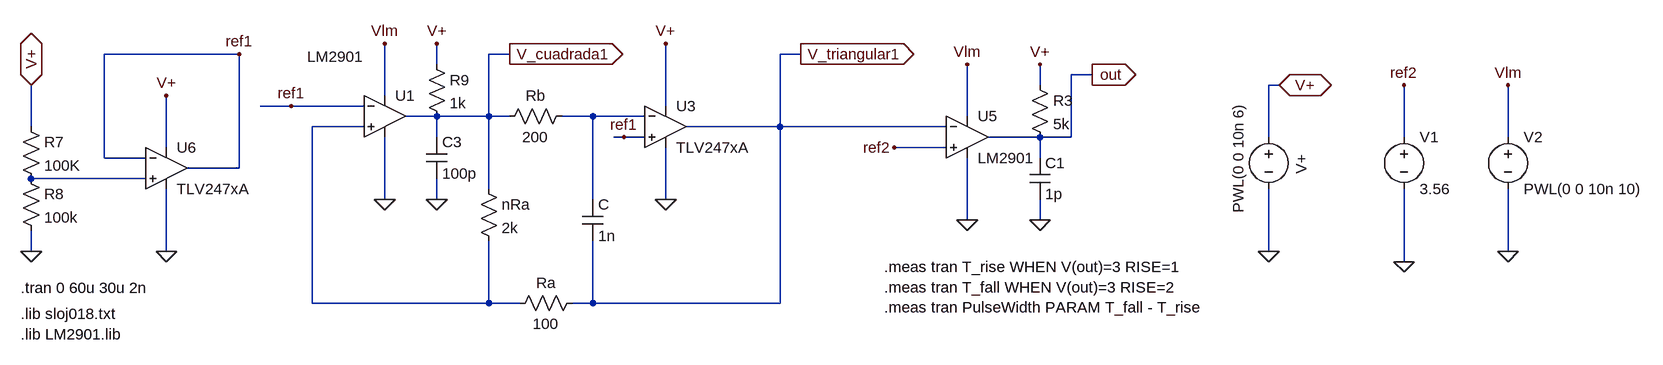
[diagram p0: schematic PWM.asc]
PWM.asc, the LTspice schematic file:
Version 4
SHEET 1 1432 1160
WIRE -752 -368 -960 -368
WIRE -336 -368 -368 -368
WIRE 112 -368 80 -368
WIRE -448 -352 -448 -384
WIRE 560 -336 528 -336
WIRE 480 -320 480 -352
WIRE 848 -320 832 -320
WIRE -528 -304 -528 -384
WIRE -672 -288 -720 -288
WIRE -560 -288 -672 -288
WIRE -96 -288 -96 -384
WIRE -448 -272 -496 -272
WIRE -368 -272 -368 -368
WIRE -368 -272 -448 -272
WIRE -336 -272 -368 -272
WIRE -208 -272 -256 -272
WIRE -128 -272 -208 -272
WIRE 368 -272 368 -352
WIRE -1072 -256 -1072 -320
WIRE -560 -256 -640 -256
WIRE 80 -256 80 -368
WIRE 80 -256 -64 -256
WIRE 336 -256 80 -256
WIRE -448 -240 -448 -272
WIRE -160 -240 -176 -240
WIRE -128 -240 -160 -240
WIRE 480 -240 400 -240
WIRE 528 -240 528 -336
WIRE 528 -240 480 -240
WIRE 832 -240 832 -320
WIRE 1040 -240 1040 -320
WIRE 1200 -240 1200 -320
WIRE -864 -224 -864 -304
WIRE 336 -224 256 -224
WIRE -960 -208 -960 -368
WIRE -896 -208 -960 -208
WIRE 480 -208 480 -240
WIRE -752 -192 -752 -368
WIRE -752 -192 -832 -192
WIRE -896 -176 -1072 -176
WIRE -368 -160 -368 -272
WIRE -528 -144 -528 -240
WIRE -448 -144 -448 -176
WIRE -208 -144 -208 -272
WIRE -96 -144 -96 -224
WIRE 368 -112 368 -208
WIRE 480 -112 480 -144
WIRE -1072 -64 -1072 -96
WIRE -864 -64 -864 -160
WIRE 832 -64 832 -160
WIRE 1200 -64 1200 -160
WIRE 1040 -48 1040 -160
WIRE -640 16 -640 -256
WIRE -368 16 -368 -80
WIRE -368 16 -640 16
WIRE -320 16 -368 16
WIRE -208 16 -208 -80
WIRE -208 16 -240 16
WIRE 80 16 80 -256
WIRE 80 16 -208 16
FLAG 832 -64 0
FLAG 848 -320 V+
IOPIN 848 -320 BiDir
FLAG 112 -368 V_triangular1
IOPIN 112 -368 Out
FLAG -336 -368 V_cuadrada1
IOPIN -336 -368 Out
FLAG -528 -384 Vlm
FLAG -96 -384 V+
FLAG 560 -336 out
IOPIN 560 -336 Out
FLAG 368 -352 Vlm
FLAG -864 -304 V+
FLAG 368 -112 0
FLAG -1072 -64 0
FLAG -1072 -320 V+
IOPIN -1072 -320 BiDir
FLAG -752 -368 ref1
FLAG -672 -288 ref1
FLAG -160 -240 ref1
FLAG -96 -144 0
FLAG -528 -144 0
FLAG -864 -64 0
FLAG 256 -224 ref2
FLAG 480 -112 0
FLAG 480 -352 V+
FLAG 1200 -64 0
FLAG 1200 -320 Vlm
FLAG -448 -144 0
FLAG -448 -384 V+
FLAG 1040 -48 0
FLAG 1040 -320 ref2
SYMBOL voltage 832 -256 R0
WINDOW 123 0 0 Left 0
WINDOW 39 0 0 Left 0
WINDOW 0 50 43 VRight 2
WINDOW 3 -47 -36 VRight 2
SYMATTR InstName V+
SYMATTR Value PWL(0 0 10n 6)
SYMBOL res -240 -288 R90
WINDOW 0 0 56 VBottom 2
WINDOW 3 32 56 VTop 2
SYMATTR InstName Rb
SYMATTR Value 200
SYMBOL res -224 0 R90
WINDOW 0 0 56 VBottom 2
WINDOW 3 32 56 VTop 2
SYMATTR InstName Ra
SYMATTR Value 100
SYMBOL res -384 -176 R0
SYMATTR InstName nRa
SYMATTR Value 2k
SYMBOL cap -224 -144 R0
SYMATTR InstName C
SYMATTR Value 1n
SYMBOL opamp2 -96 -320 R0
SYMATTR InstName U3
SYMATTR Value TLV247xA
SYMBOL opamp2 368 -304 R0
SYMATTR InstName U5
SYMATTR Value LM2901
SYMBOL opamp2 -864 -256 R0
SYMATTR InstName U6
SYMATTR Value TLV247xA
SYMBOL res -1088 -272 R0
SYMATTR InstName R7
SYMATTR Value 100K
SYMBOL res -1088 -192 R0
SYMATTR InstName R8
SYMATTR Value 100k
SYMBOL res 464 -336 R0
SYMATTR InstName R3
SYMATTR Value 5k
SYMBOL cap 464 -208 R0
SYMATTR InstName C1
SYMATTR Value 1p
SYMBOL voltage 1200 -256 R0
WINDOW 123 0 0 Left 0
WINDOW 39 0 0 Left 0
SYMATTR InstName V2
SYMATTR Value PWL(0 0 10n 10)
SYMBOL cap -464 -240 R0
SYMATTR InstName C3
SYMATTR Value 100p
SYMBOL res -464 -368 R0
SYMATTR InstName R9
SYMATTR Value 1k
SYMBOL opamp2 -528 -336 R0
WINDOW 3 -119 -28 Left 2
SYMATTR Value LM2901
SYMATTR InstName U1
SYMBOL Voltage 1040 -256 R0
SYMATTR InstName V1
SYMATTR Value 3.56
TEXT -1088 -8 Left 2 !.tran 0 60u 30u 2n
TEXT -1088 32 Left 2 !.lib sloj018.txt
TEXT -1088 64 Left 2 !.lib LM2901.lib
TEXT 240 -40 Left 2 !.meas tran T_rise WHEN V(out)=3 RISE=1\n.meas tran T_fall WHEN V(out)=3 RISE=2\n.meas tran PulseWidth PARAM T_fall - T_rise

The netlist it stands for:
* PWM.asc
V+ V+ 0 PWL(0 0 10n 6)
Rb N001 V_cuadrada1 200
Ra V_triangular1 N002 100
R§nRa V_cuadrada1 N002 2k
C N001 V_triangular1 1n
XU3 ref1 N001 V+ 0 V_triangular1 TLV247xA  ; pins In+ In- V+ V- OUT
XU5 ref2 V_triangular1 Vlm 0 out LM2901  ; pins In+ In- V+ V- OUT
XU6 N003 ref1 V+ 0 ref1 TLV247xA  ; pins In+ In- V+ V- OUT
R7 V+ N003 100K
R8 N003 0 100k
R3 V+ out 5k
C1 out 0 1p
V2 Vlm 0 PWL(0 0 10n 10)
C3 V_cuadrada1 0 100p
R9 V+ V_cuadrada1 1k
XU1 N002 ref1 Vlm 0 V_cuadrada1 LM2901  ; pins In+ In- V+ V- OUT
V1 ref2 0 3.56
.tran 0 60u 30u 2n
.lib sloj018.txt
.lib LM2901.lib
.meas tran T_rise WHEN V(out)=3 RISE=1
.meas tran T_fall WHEN V(out)=3 RISE=2
.meas tran PulseWidth PARAM T_fall - T_rise
.backanno
.end